# EasyEDA Pro project AQM V1 Rev2.epro

# Schematic Schematic1
Board Name: Board1; Create Date: 2024-08-23; Page Name: AQM; Project Name: Air Quality Monitor; Schematic Name: Schematic1; Update Date: 2024-09-13
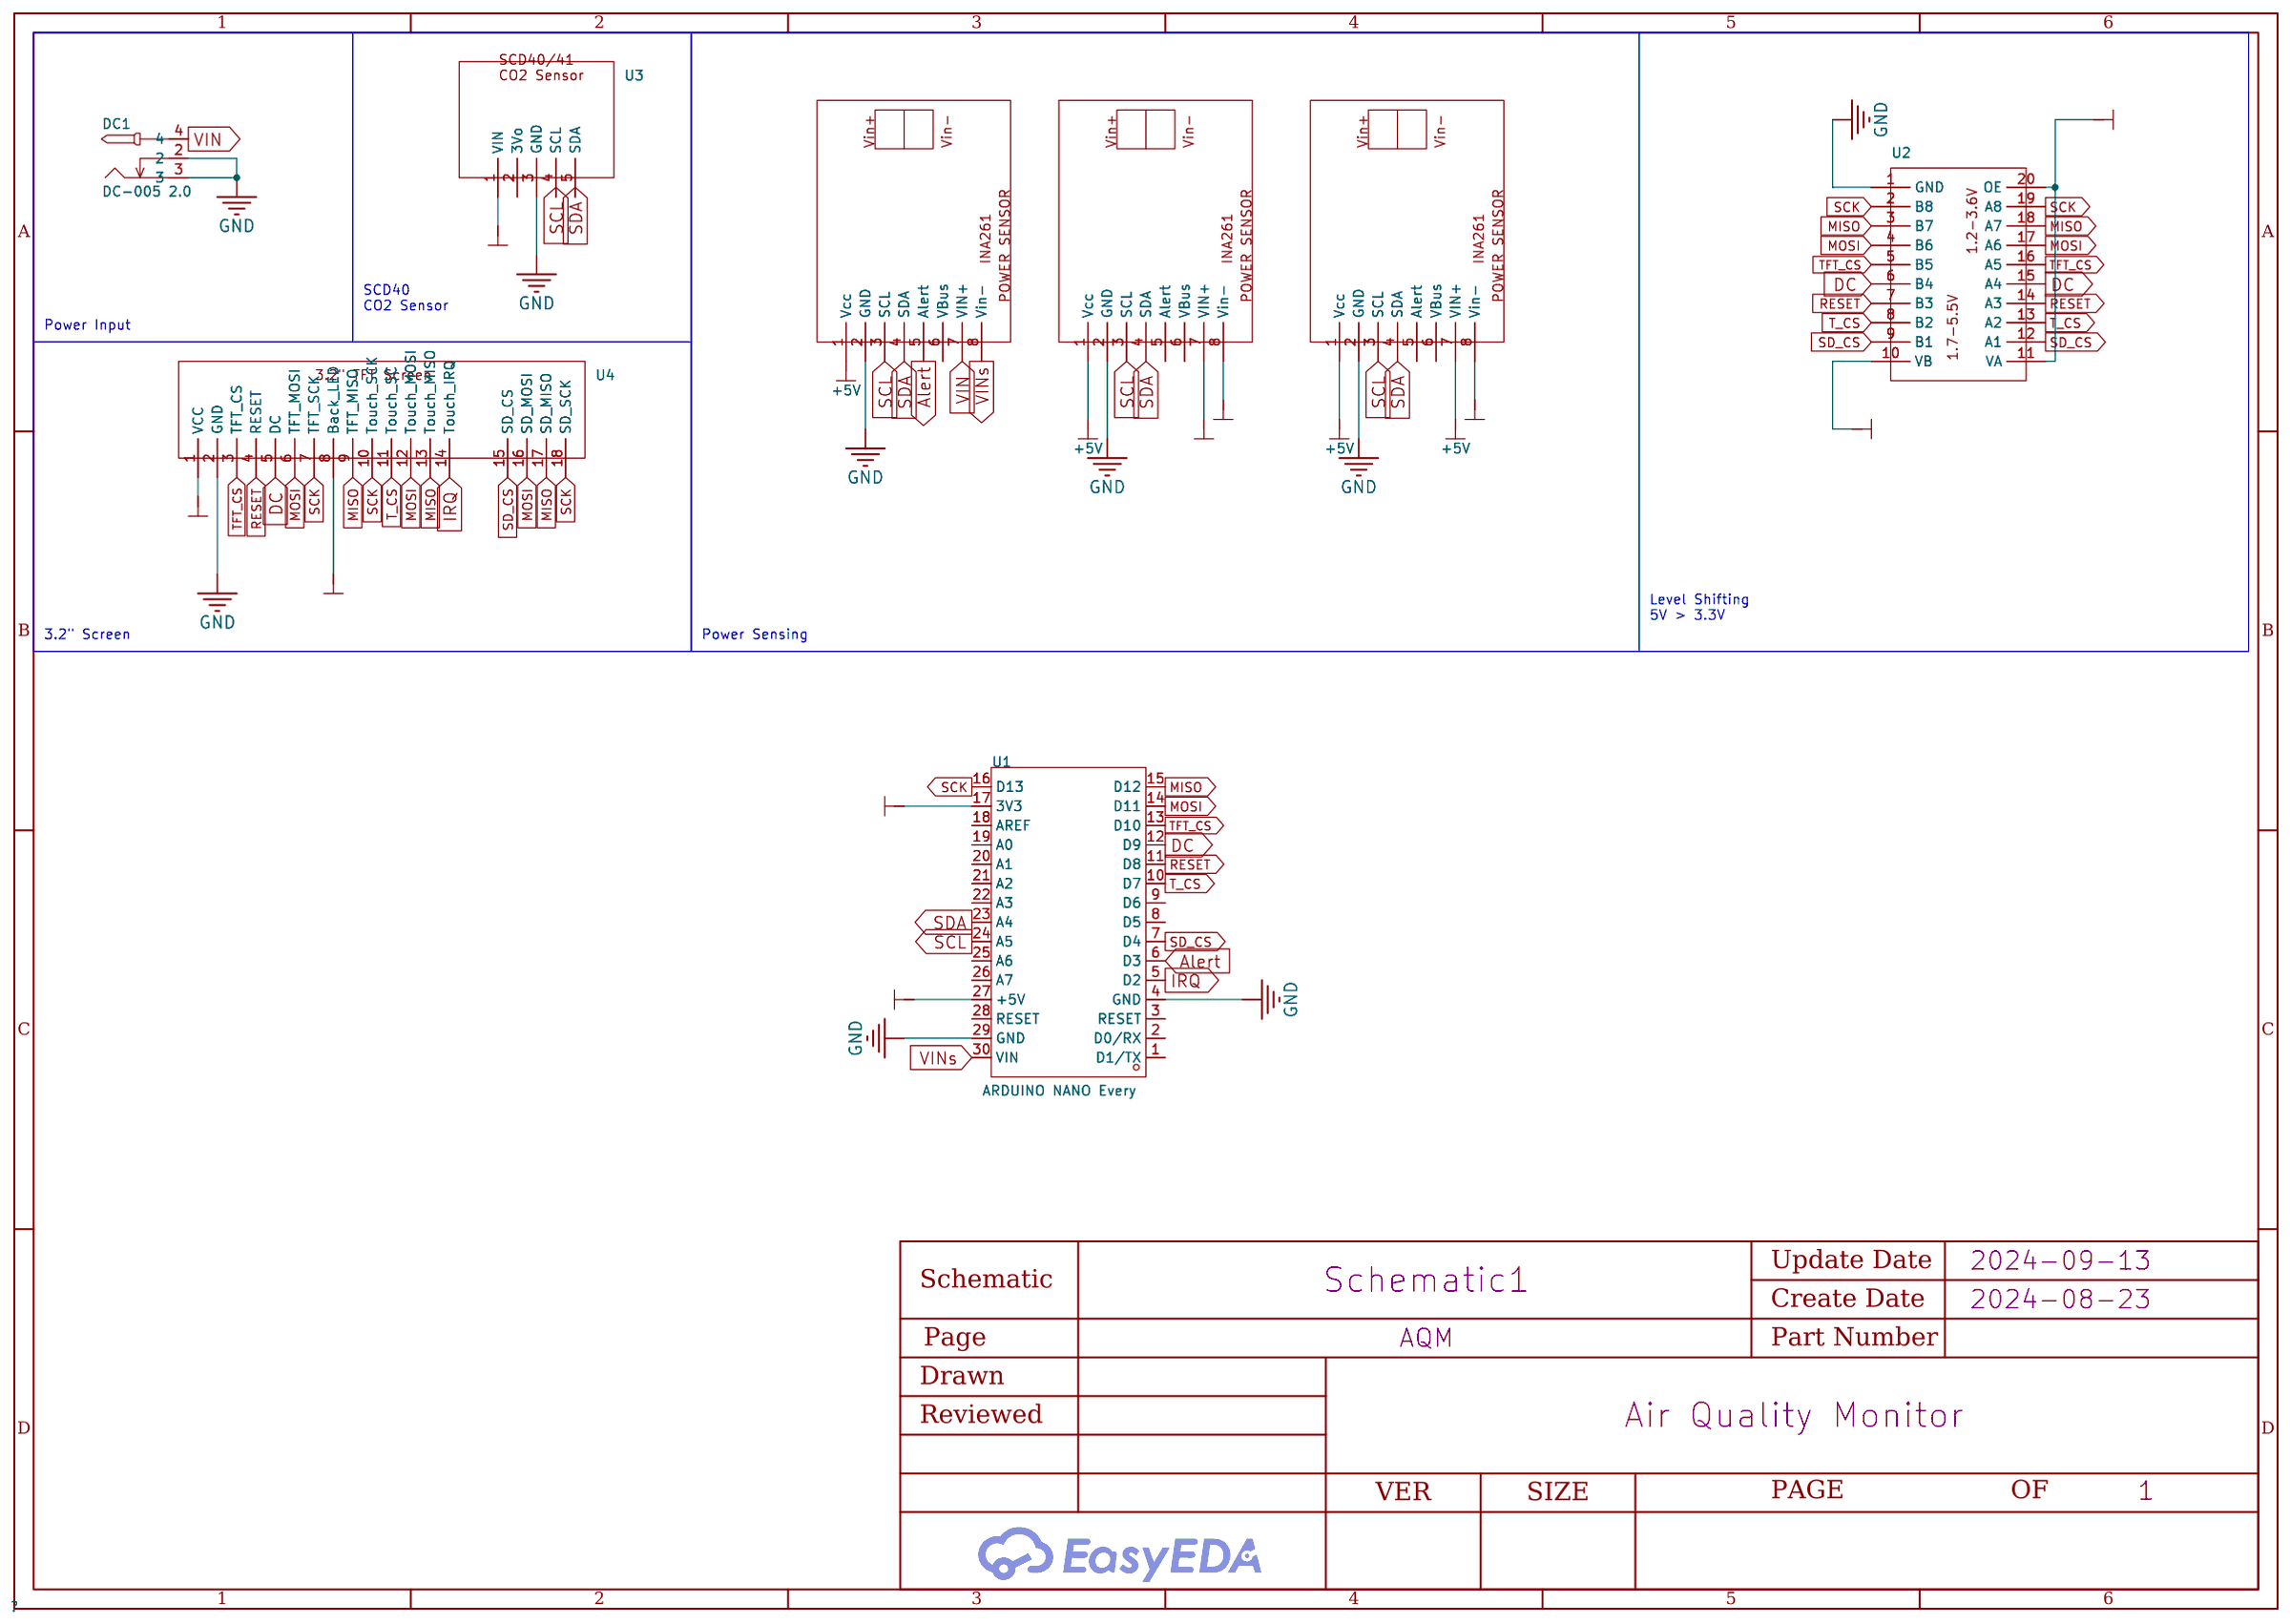
[diagram p0: schematic sheet]

## Parts
3.3V  -  [INA260 Breakout]
5V  -  [INA260 Breakout]
DC1  DC-005 2.0  [DC-IN-TH_DC-5520-1]
U1  ARDUINO NANO Every  [COMM-TH_ARDUINO_NANO]
U2  -  [8 Channel Level Shifter Footprint]
U3  -  [Adafruit SCD40/41]
U4  -  [2.8" TFT Display Footprint 1]
VIN  -  [INA260 Breakout]

## Library data of the parts
3.3V 5V VIN = INA260 Breakout: Adafruit INA260 High or Low Side Voltage, Current, Power Sensor
DC1 = DC-005 2.0: Connector Type:DC Power Receptacle Mounting Style:Right-Angle Inside Contact Diameter:2mm Outside Contact Diameter:6.4mm Current Rating (Max):- Voltage Rating (Max):- Operating Temperature Range:- Operating Temperature Range:-; LCSC Part Name: DC电源插座 内径:2mm 外径:6.4mm; Supplier Part: C16214; Manufacturer: BOOMELE(博穆精密); Supplier Footprint: 插件; JLCPCB Part Class: Extended Part; Datasheet: https://atta.szlcsc.com/upload/public/pdf/source/20230822/A395081E7D04348211A5D528B2AFD8E0.pdf; Supplier: LCSC; Connector Type: DC Power Receptacle; Mounting Style: Right-Angle; Inside Contact Diameter: 2mm; Outside Contact Diameter: 6.4mm
U1 = ARDUINO_NANO: Supplier: LCSC; Supplier Part: C9900017879; JLCPCB Part Class: Extended Part; Supplier Footprint: 插件
U2 = 8 Channel Level Shifter: Level Shifter for 8 Channels from 3.3V to 5V
U3 = Adafruit SCD40/41 Breakout
U4 = 2.8" TFT Screen (SPI, Touch, SD): 2.8" TFT Screen with SPI, Touch and SD Card.

## Nets
+3V: 3.3V.7(VIN+) U1.17(3V3)
+3VS: 3.3V.8(Vin-) U2.11(VA) U2.20(OE) U4.8(Back_LED)
+5V: 3.3V.1(Vcc) 5V.1(Vcc) 5V.7(VIN+) U1.27(+5V) VIN.1(Vcc)
+5VS: 5V.8(Vin-) U2.10(VB) U3.1(VIN) U4.1(VCC)
GND: 3.3V.2(GND) 5V.2(GND) DC1.2 DC1.3 U1.4(GND) U1.29(GND) U2.1(GND) U3.3(GND) U4.2(GND) VIN.2(GND)
VIN: DC1.4 VIN.7(VIN+)
VINs: U1.30(VIN) VIN.8(Vin-)
Alert: U1.6(D3) VIN.5(Alert)
DC: U1.12(D9) U2.6(B4) U2.15(A4) U4.5(DC)
IRQ: U1.5(D2) U4.14(Touch_IRQ)
MISO: U1.15(D12) U2.3(B7) U2.18(A7) U4.9(TFT_MISO) U4.13(Touch_MISO) U4.17(SD_MISO)
MOSI: U1.14(D11) U2.4(B6) U2.17(A6) U4.6(TFT_MOSI) U4.12(Touch_MOSI) U4.16(SD_MOSI)
RESET: U1.11(D8) U2.7(B3) U2.14(A3) U4.4(RESET)
SCK: U1.16(D13) U2.2(B8) U2.19(A8) U4.7(TFT_SCK) U4.10(Touch_SCK) U4.18(SD_SCK)
SCL: 3.3V.3(SCL) 5V.3(SCL) U1.24(A5) U3.4(SCL) VIN.3(SCL)
SD_CS: U1.7(D4) U2.9(B1) U2.12(A1) U4.15(SD_CS)
SDA: 3.3V.4(SDA) 5V.4(SDA) U1.23(A4) U3.5(SDA) VIN.4(SDA)
T_CS: U1.10(D7) U2.8(B2) U2.13(A2) U4.11(Touch_SC)
TFT_CS: U1.13(D10) U2.5(B5) U2.16(A5) U4.3(TFT_CS)

Not connected (* = marked no-connect by the designer): 3.3V 5(Alert) 6(VBus); 5V 5(Alert) 6(VBus); U1 1(D1/TX) 2(D0/RX) 3(RESET) 8(D5) 9(D6) 18(AREF) 19(A0) 20(A1) 21(A2) 22(A3) 25(A6) 26(A7) 28(RESET); U3 2(3Vo); VIN 6(VBus)

## Notes on the sheet
- SCD40
  CO2 Sensor
- Power Input
- Level Shifting
  5V > 3.3V
- 3.2" Screen
- Power Sensing
